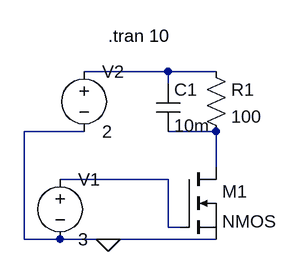
[diagram p0: schematic Draft47.asc]
Draft47.asc, the LTspice schematic file:
Version 4
SHEET 1 880 680
WIRE 240 144 128 144
WIRE 304 144 240 144
WIRE 240 160 240 144
WIRE 128 224 48 224
WIRE 304 224 240 224
WIRE 304 272 304 224
WIRE 240 288 96 288
WIRE 240 352 240 288
WIRE 256 352 240 352
WIRE 48 368 48 224
WIRE 96 368 48 368
WIRE 160 368 96 368
WIRE 304 368 160 368
FLAG 160 368 0
SYMBOL voltage 96 272 R0
SYMATTR InstName V1
SYMATTR Value 3
SYMBOL nmos 256 272 R0
SYMATTR InstName M1
SYMBOL res 288 128 R0
SYMATTR InstName R1
SYMATTR Value 100
SYMBOL cap 224 160 R0
SYMATTR InstName C1
SYMATTR Value 10m
SYMBOL voltage 128 128 R0
SYMATTR InstName V2
SYMATTR Value 2
TEXT 160 96 Left 2 !.tran 10

The netlist it stands for:
* Draft47.asc
V1 N003 0 3
M1 N002 N003 0 0 NMOS
R1 N001 N002 100
C1 N001 N002 10m
V2 N001 0 2
.model NMOS NMOS
.model PMOS PMOS
.lib standard.mos
.tran 10
.backanno
.end